# Altium schematic sheet EVK-IRIS-W1-SRAM_RESET_STRAPING.SchDoc: Top Level Design
size A3; CompanyName: Rigado, LLC; Organization: Rigado; DocumentNumber: 11; SheetNumber: 11; SheetTotal: 14; Website: www.rigado.com; SheetSize: B
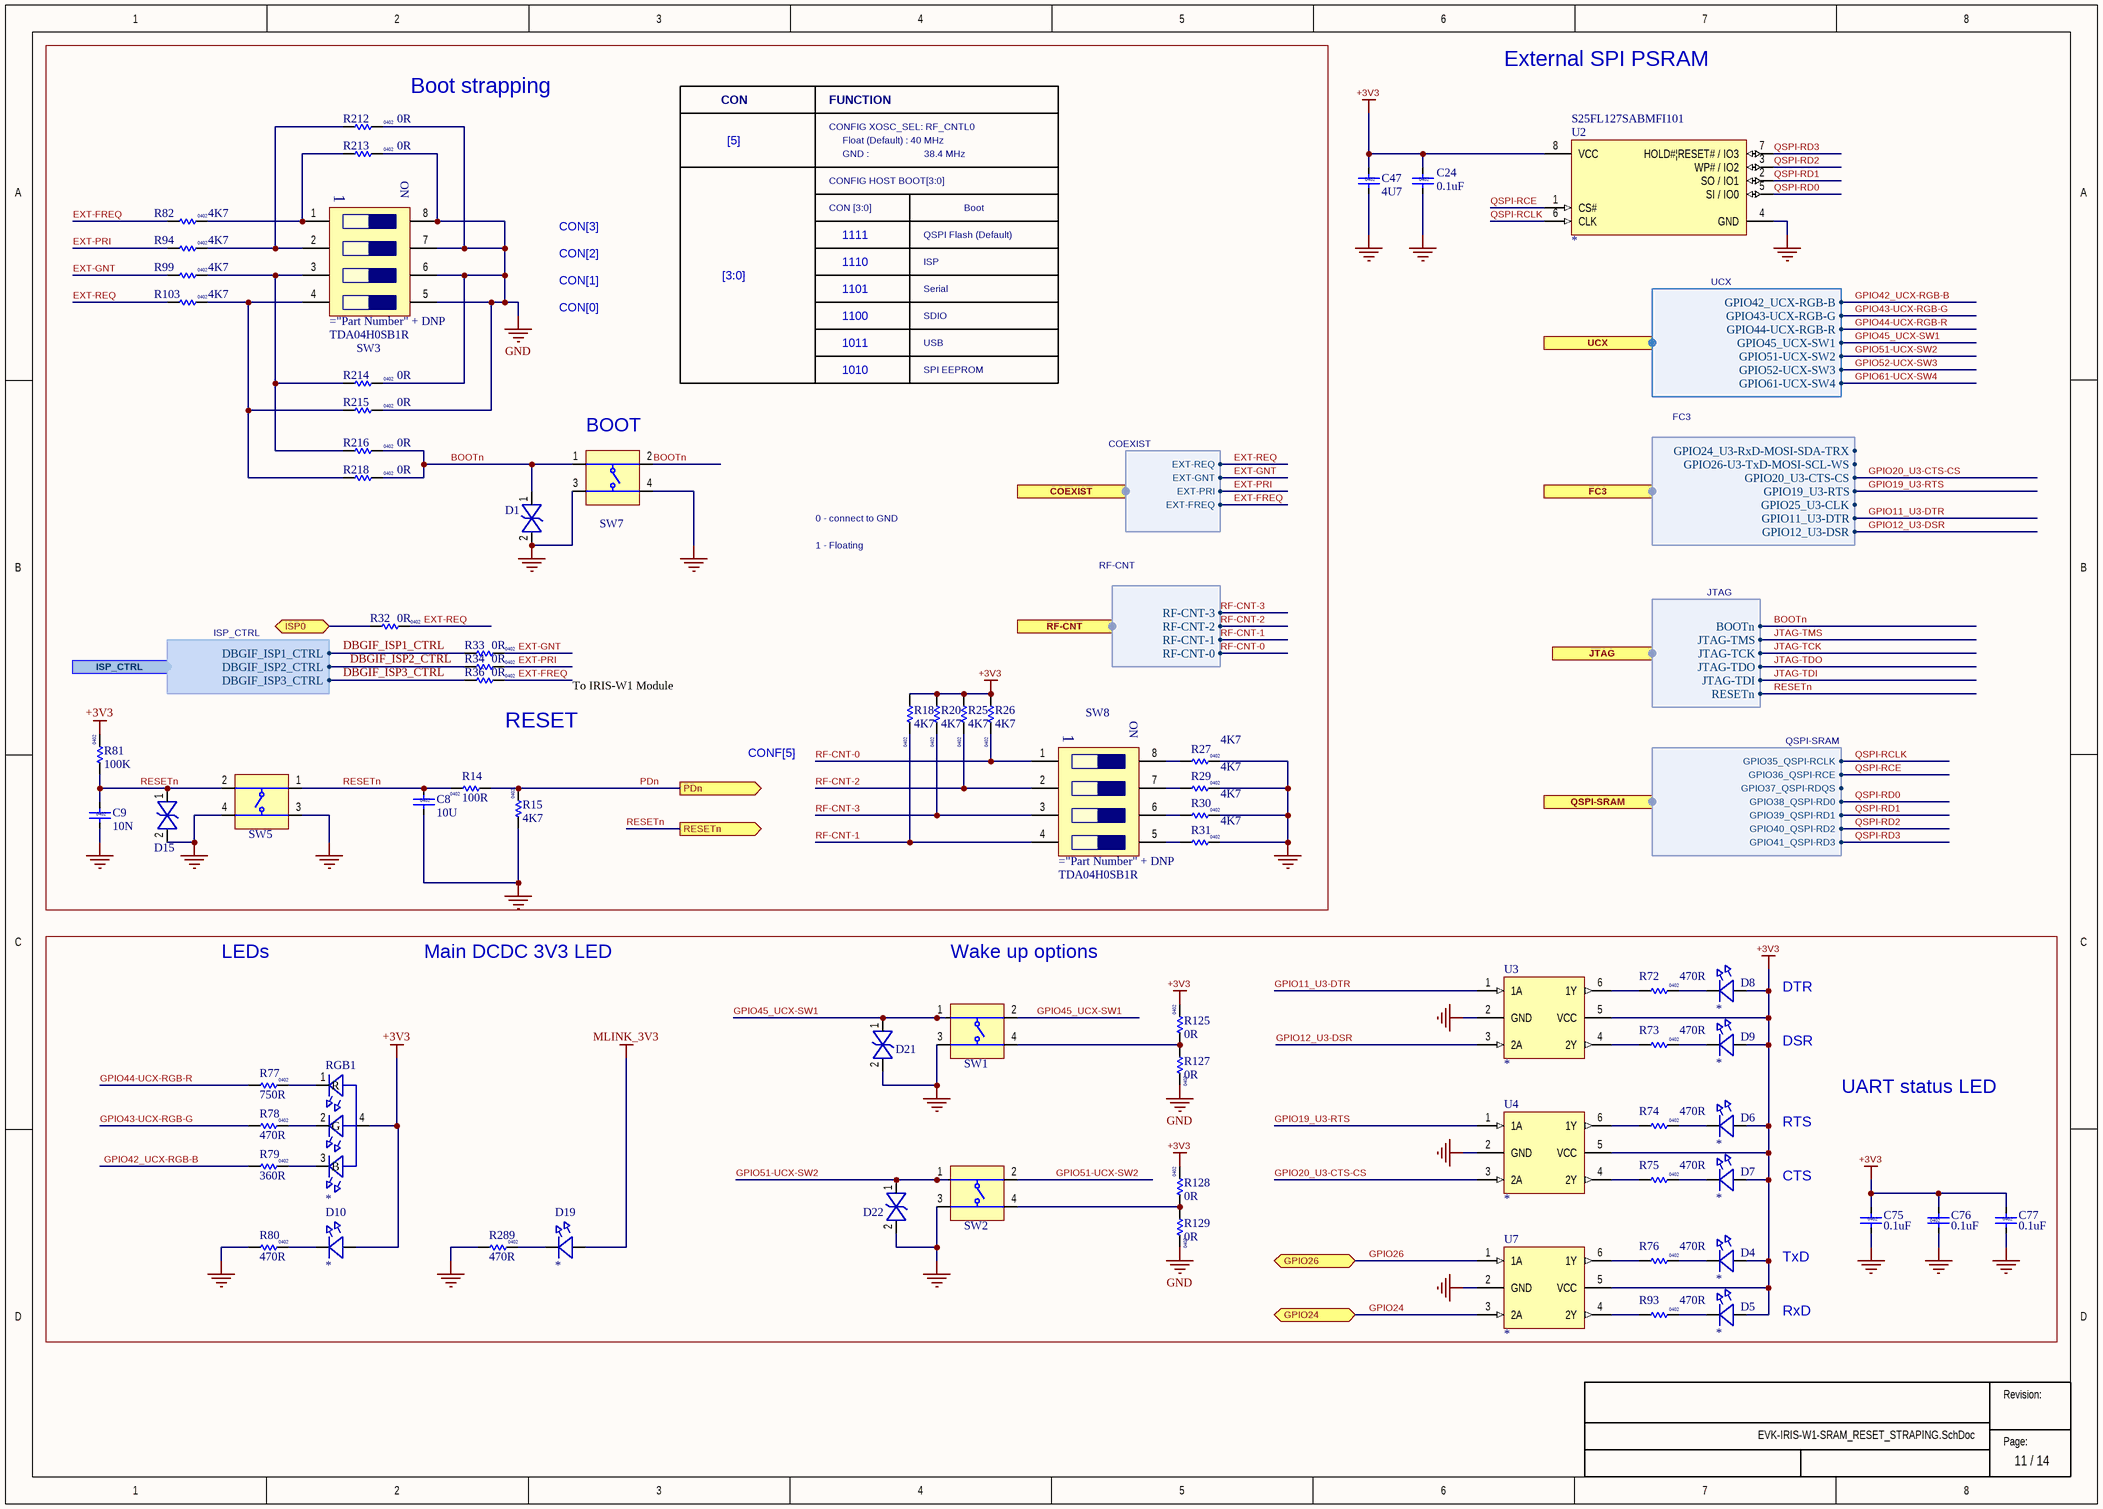
[diagram p0: EVK-IRIS-W1-SRAM_RESET_STRAPING.SchDoc]

## Parts
C8  value 10U  Size: 0402  [Cap 0402 HD]
C9  value 10N  Size: 0402  [Cap 0402]
C24  value 0.1uF  Size: 0402  [Cap 0402 HD]
C47  value 4U7  Size: 0402  [Cap 0402 HD]
C75  value 0.1uF  Size: 0402  [Cap 0402 HD]
C76  value 0.1uF  Size: 0402  [Cap 0402 HD]
C77  value 0.1uF  Size: 0402  [Cap 0402 HD]
D1  (no value)  [SOD-923]
D4  (no value)  [LED-0603]
D5  (no value)  [LED-0603]
D6  (no value)  [LED-0603]
D7  (no value)  [LED-0603]
D8  (no value)  [LED-0603]
D9  (no value)  [LED-0603]
D10  (no value)  [LED-0603]
D15  (no value)  [SOD-923]
D19  (no value)  [LED-0603]
D21  (no value)  [SOD-923]
D22  (no value)  [SOD-923]
R14  value 100R  Size: 0402  [RES 0402 HD]
R15  value 4K7  Size: 0402  [RES 0402 HD]
R18  value 4K7  Size: 0402  [RES 0402 HD]
R20  value 4K7  Size: 0402  [RES 0402 HD]
R25  value 4K7  Size: 0402  [RES 0402 HD]
R26  value 4K7  Size: 0402  [RES 0402 HD]
R27  value 4K7  Size: 0402  [RES 0402 HD]
R29  value 4K7  Size: 0402  [RES 0402 HD]
R30  value 4K7  Size: 0402  [RES 0402 HD]
R31  value 4K7  Size: 0402  [RES 0402 HD]
R32  value 0R  Size: 0402  [RES 0402 HD]
R33  value 0R  Size: 0402  [RES 0402 HD]
R34  value 0R  Size: 0402  [RES 0402 HD]
R36  value 0R  Size: 0402  [RES 0402 HD]
R72  value 470R  Size: 0402  [RES 0402 HD]
R73  value 470R  Size: 0402  [RES 0402 HD]
R74  value 470R  Size: 0402  [RES 0402 HD]
R75  value 470R  Size: 0402  [RES 0402 HD]
R76  value 470R  Size: 0402  [RES 0402 HD]
R77  value 750R  Size: 0402  [RES 0402 HD]
R78  value 470R  Size: 0402  [RES 0402 HD]
R79  value 360R  Size: 0402  [RES 0402 HD]
R80  value 470R  Size: 0402  [RES 0402 HD]
R81  value 100K  Size: 0402  [RES 0402 HD]
R82  value 4K7  Size: 0402  [RES 0402 HD]
R93  value 470R  Size: 0402  [RES 0402 HD]
R94  value 4K7  Size: 0402  [RES 0402 HD]
R99  value 4K7  Size: 0402  [RES 0402 HD]
R103  value 4K7  Size: 0402  [RES 0402 HD]
R125  value 0R  Size: 0402  [RES 0402 HD]
R127  value 0R  Size: 0402  [RES 0402 HD]
R128  value 0R  Size: 0402  [RES 0402 HD]
R129  value 0R  Size: 0402  [RES 0402 HD]
R212  value 0R  Size: 0402  [RES 0402 HD]
R213  value 0R  Size: 0402  [RES 0402 HD]
R214  value 0R  Size: 0402  [RES 0402 HD]
R215  value 0R  Size: 0402  [RES 0402 HD]
R216  value 0R  Size: 0402  [RES 0402 HD]
R218  value 0R  Size: 0402  [RES 0402 HD]
R289  value 470R  Size: 0402  [RES 0402 HD]
RGB1  (no value)  [LED_1616]
SW1  (no value)  [SW_TACT_SMT_6mm]
SW2  (no value)  [SW_TACT_SMT_6mm]
SW3  (no value)  [SOP1.27P6.2x6.2-8Pin]
SW5  (no value)  [SW_TACT_SMT_6mm]
SW7  (no value)  [SW_TACT_SMT_6mm]
SW8  (no value)  [SOP1.27P6.2x6.2-8Pin]
U2  Manufacturer Part Number 1: S25FL127SABMFI101  [SOIC-8W]
U3  (no value)  [SC70-6]
U4  (no value)  [SC70-6]
U7  (no value)  [SC70-6]

## Ports
COEXIST (harness COEXIST), FC3 (harness FC3), GPIO24 (bidir), GPIO26 (bidir), ISP0 (bidir), ISP_CTRL (harness ISP_CTRL), JTAG (harness JTAG), PDn (out), QSPI-SRAM (harness QSPI-SRAM), RESETn (out), RF-CNT (harness RF-CNT), UCX (harness UCX)

## Harnesses
QSPI-SRAM: GPIO35_QSPI-RCLK, GPIO36_QSPI-RCE, GPIO37_QSPI-RDQS, GPIO38_QSPI-RD0, GPIO39_QSPI-RD1, GPIO40_QSPI-RD2, GPIO41_QSPI-RD3
COEXIST: EXT-REQ, EXT-GNT, EXT-PRI, EXT-FREQ
RF-CNT: RF-CNT-0, RF-CNT-1, RF-CNT-2, RF-CNT-3
ISP_CTRL: DBGIF_ISP1_CTRL, DBGIF_ISP2_CTRL, DBGIF_ISP3_CTRL
UCX: GPIO42_UCX-RGB-B, GPIO43-UCX-RGB-G, GPIO44-UCX-RGB-R, GPIO45_UCX-SW1, GPIO51-UCX-SW2, GPIO52-UCX-SW3, GPIO61-UCX-SW4
FC3: GPIO20_U3-CTS-CS, GPIO19_U3-RTS, GPIO24_U3-RxD-MOSI-SDA-TRX, GPIO26-U3-TxD-MOSI-SCL-WS, GPIO25_U3-CLK, GPIO11_U3-DTR, GPIO12_U3-DSR
JTAG: JTAG-TCK, JTAG-TDI, JTAG-TDO, JTAG-TMS, RESETn, BOOTn

## Nets
+3V3: C24.1 C47.1 C75.1 C76.1 C77.1 D4.2(A) D5.2(A) D6.2(A) D7.2(A) D8.2(A) D9.2(A) D10.2(A) R18.2 R20.2 R25.2 R26.2 R81.2 R125.2 R128.2 RGB1.4(A) U2.8(VCC) U3.5(VCC) U4.5(VCC) U7.5(VCC)
GND: C8.2 C9.2 C24.2 C47.2 C75.2 C76.2 C77.2 D1.2 D15.2 D21.2 D22.2 R15.1 R27.2 R29.2 R30.2 R31.2 R80.1 R127.2 R129.2 R212.2 R213.2 R214.2 R215.2 R289.1 SW1.3(T3) SW2.3(T3) SW3.5 SW3.6 SW3.7 SW3.8 SW5.3(T3) SW5.4(T3) SW7.3(T3) SW7.4(T3) U2.4(GND) U3.2(GND) U4.2(GND) U7.2(GND)
MLINK_3V3: D19.2(A)
BOOTn: D1.1 R216.2 R218.2 SW7.1(T1) SW7.2(T2) ; port JTAG.BOOTn
DBGIF_ISP1_CTRL: R33.1 ; port ISP_CTRL.DBGIF_ISP1_CTRL
DBGIF_ISP2_CTRL: R34.1 ; port ISP_CTRL.DBGIF_ISP2_CTRL
DBGIF_ISP3_CTRL: R36.1 ; port ISP_CTRL.DBGIF_ISP3_CTRL
EXT-FREQ: R36.2 R82.1 ; port COEXIST.EXT-FREQ
EXT-GNT: R33.2 R99.1 ; port COEXIST.EXT-GNT
EXT-PRI: R34.2 R94.1 ; port COEXIST.EXT-PRI
EXT-REQ: R32.2 R103.1 ; port COEXIST.EXT-REQ
GPIO11_U3-DTR: U3.1(1A) ; port FC3.GPIO11_U3-DTR
GPIO12_U3-DSR: U3.3(2A) ; port FC3.GPIO12_U3-DSR
GPIO19_U3-RTS: U4.1(1A) ; port FC3.GPIO19_U3-RTS
GPIO20_U3-CTS-CS: U4.3(2A) ; port FC3.GPIO20_U3-CTS-CS
GPIO24: U7.3(2A) ; port GPIO24
GPIO26: U7.1(1A) ; port GPIO26
GPIO42_UCX-RGB-B: R79.1 ; port UCX.GPIO42_UCX-RGB-B
GPIO43-UCX-RGB-G: R78.1 ; port UCX.GPIO43-UCX-RGB-G
GPIO44-UCX-RGB-R: R77.1 ; port UCX.GPIO44-UCX-RGB-R
GPIO45_UCX-SW1: D21.1 SW1.1(T1) SW1.2(T2) ; port UCX.GPIO45_UCX-SW1
GPIO51-UCX-SW2: D22.1 SW2.1(T1) SW2.2(T2) ; port UCX.GPIO51-UCX-SW2
GPIO52-UCX-SW3: port UCX.GPIO52-UCX-SW3
GPIO61-UCX-SW4: port UCX.GPIO61-UCX-SW4
ISP0: R32.1 ; port ISP0
JTAG-TCK: port JTAG.JTAG-TCK
JTAG-TDI: port JTAG.JTAG-TDI
JTAG-TDO: port JTAG.JTAG-TDO
JTAG-TMS: port JTAG.JTAG-TMS
PDn: R14.1 R15.2 ; port PDn
QSPI-RCE: U2.1(CS#) ; port QSPI-SRAM.GPIO36_QSPI-RCE
QSPI-RCLK: U2.6(CLK) ; port QSPI-SRAM.GPIO35_QSPI-RCLK
QSPI-RD0: U2.5(SI_/_IO0) ; port QSPI-SRAM.GPIO38_QSPI-RD0
QSPI-RD1: U2.2(SO_/_IO1) ; port QSPI-SRAM.GPIO39_QSPI-RD1
QSPI-RD2: U2.3(WP#_/_IO2) ; port QSPI-SRAM.GPIO40_QSPI-RD2
QSPI-RD3: U2.7(HOLD#|RESET#_/_IO3) ; port QSPI-SRAM.GPIO41_QSPI-RD3
RESETn: C8.1 C9.1 D15.1 R14.2 R81.1 SW5.1(T1) SW5.2(T2) ; port RESETn, port JTAG.RESETn
RF-CNT-0: R26.1 SW8.1 ; port RF-CNT.RF-CNT-0
RF-CNT-1: R18.1 SW8.4 ; port RF-CNT.RF-CNT-1
RF-CNT-2: R25.1 SW8.2 ; port RF-CNT.RF-CNT-2
RF-CNT-3: R20.1 SW8.3 ; port RF-CNT.RF-CNT-3
NetD4_1: D4.1(C) R76.2
NetD5_1: D5.1(C) R93.2
NetD6_1: D6.1(C) R74.2
NetD7_1: D7.1(C) R75.2
NetD8_1: D8.1(C) R72.2
NetD9_1: D9.1(C) R73.2
NetD10_1: D10.1(C) R80.2
NetD19_1: D19.1(C) R289.2
NetR27_1: R27.1 SW8.8
NetR29_1: R29.1 SW8.7
NetR30_1: R30.1 SW8.6
NetR31_1: R31.1 SW8.5
NetR72_1: R72.1 U3.6(1Y)
NetR73_1: R73.1 U3.4(2Y)
NetR74_1: R74.1 U4.6(1Y)
NetR75_1: R75.1 U4.4(2Y)
NetR76_1: R76.1 U7.6(1Y)
NetR77_2: R77.2 RGB1.1(R)
NetR78_2: R78.2 RGB1.2(G)
NetR79_2: R79.2 RGB1.3(B)
NetR82_2: R82.2 R213.1 SW3.1
NetR93_1: R93.1 U7.4(2Y)
NetR94_2: R94.2 R212.1 SW3.2
NetR99_2: R99.2 R214.1 R216.1 SW3.3
NetR103_2: R103.2 R215.1 R218.1 SW3.4
NetR125_1: R125.1 R127.1 SW1.4(T3)
NetR128_1: R128.1 R129.1 SW2.4(T3)

## Notes on the sheet
- Boot strapping
- CON
- FUNCTION
- External SPI PSRAM
- [5]
- CONFIG XOSC_SEL: RF_CNTL0
- CONFIG HOST BOOT[3:0]
- Float (Default) : 40 MHz
- GND :                      38.4 MHz
- CON[3]
- CON [3:0]
- 1111
- QSPI Flash (Default)
- Boot
- CON[2]
- CON[1]
- CON[0]
- [3:0]
- 1110
- 1101
- 1100
- SDIO
- Serial
- ISP
- 1011
- 1010
- USB
- SPI EEPROM
- (near SW7) BOOT
- 0 - connect to GND
- 1 - Floating
- To IRIS-W1 Module
- RESET
- CONF[5]
- LEDs
- Main DCDC 3V3 LED
- Wake up options
- DTR
- DSR
- RTS
- UART status LED
- CTS
- TxD
- RxD
- Revision:
- Page:
- (in symbol 137-00012) ON

## Library data of the parts
C8 = UBXH01-0000244: CAP CER X5R 0402 10U 20% 10V; Manufacturer: Murata Manufacturing Company, Ltd.; Manufacturer P/N: GRM155R61A106ME11; Editor: dario.antonaz; Released by: jure.podmenik; Env: ROHS; Permitted Use: Volume Products; Perferred: PREF; Mfg P/N Status: Active; Mfg P/N Split: 0; Mfg P/N Released: Yes; Part Number: UBXH01-0000244; Tolerance: 20%; Max Voltage: 10V; Part Type: Capacitor; Release Data: 2016-03-11T16:15:50; UBX Wiki: https://wiki.u-blox.com/bin/view/Operations/PartDetails?index=24334; RefDes: C; Mfg P/N Datasheet: https://wiki.u-blox.com/bin/view/Generic/Docs/DocumentSummary?index=24333; Manufacturer 2: Samsung Electro-Mechanics; Manufacturer P/N 2: CL05A106MP5NUN; Mfg P/N Status 2: NRND; Mfg P/N Split 2: 0; Mfg P/N Released 2: Yes; Mfg P/N Datasheet 2: https://wiki.u-blox.com/bin/view/Generic/Docs/DocumentSummary?index=27636
C9 = UBXH01-0023025: CAP CER X7R 0402 10N 10% 16V; Manufacturer: Murata Manufacturing Company, Ltd.; Manufacturer P/N: GRM155R71C103KA01; Editor: roland.rust; Released by: anthony.gergis; Env: ROHS; Permitted Use: Volume Products; Perferred: PREF; Mfg P/N Status: NRND; Mfg P/N Split: 100; Mfg P/N Released: Yes; Part Number: UBXH01-0023025; Tolerance: 10%; Max Voltage: 16V; Min Operating Temp: -55°C; Max Operating Temp: 125°C; Part Type: Capacitor; Release Data: 2021-02-16T13:14:11; UBX Wiki: https://wiki.u-blox.com/bin/view/Operations/PartDetails?index=5491; RefDes: C; Manufacturer 2: Samsung Electro-Mechanics; Manufacturer P/N 2: CL05B103KO5NNNC; Mfg P/N Status 2: Active; Mfg P/N Split 2: 0; Mfg P/N Released 2: Yes; Mfg P/N Datasheet 2: https://wiki.u-blox.com/bin/view/Generic/Docs/DocumentSummary?index=28567
C24 C75-C77 = 120-00016: Cap, Ceramic 0.1uF 10V 10% X5R 0402; Part Name: CAP CER 0.1UF 10V 10% X5R 0402; Manufacturer 1: Murata Electronics North America; Manufacturer Part Number 1: GRM155R61A104KA01J; Tolerance: +/- 10%; Use in new designs: Yes; UBX Code: None; Item Phase: In Production; Part Number: 120-00016; Revision: 0A; Supplier 1: Digi-Key; Supplier Part Number 1: 490-6297-1-ND; Manufacturer 2: Yageo; Supplier 2: Digi-Key; Supplier Part Number 2: 311-1336-1-ND; Height: 0.55mm; Pins: 2; Temperature Coefficient: X5R; Voltage: 10V; Max Operating Temp: 85; Manufacturer Part Number 2: CC0402KRX5R6BB104; Min Operating Temp: -55
C47 = UBXH01-0000243: CAP CER X5R 0402 4U7 20% 10V; Manufacturer: Murata Manufacturing Company, Ltd.; Manufacturer P/N: GRM155R61A475MEAA; Editor: martin.pilik; Released by: fabrice.bret-dibat; Env: GREEN; Permitted Use: Volume Products; Perferred: PREF; Mfg P/N Status: Active; Mfg P/N Split: 100; Mfg P/N Released: Yes; Part Number: UBXH01-0000243; Tolerance: 20%; Max Voltage: 10V; Min Operating Temp: -40°C; Max Operating Temp: 85°C; Part Type: Capacitor; Release Data: 2021-05-10T12:57:47; UBX Wiki: https://wiki.u-blox.com/bin/view/Operations/PartDetails?index=24303; RefDes: C; Mfg P/N Datasheet: https://wiki.u-blox.com/bin/view/Generic/Docs/DocumentSummary?index=24302
D1 D15 D21 D22 = 110-00019: Diode, ESD9B, 3.3V, ST5G, SOD-923; Part Name: Diode TVS 3.3V SOD-923; Manufacturer 1: ON Semiconductor; Manufacturer Part Number 1: ESD9B3.3ST5G; Body Size: 0.8mm x 0.6mm; Use in new designs: Yes; UBX Code: None; Item Phase: In Production; Part Number: 110-00019; Supplier 1: Digi-Key; Supplier Part Number 1: ESD9B3.3ST5GOSCT-ND; Height: 0.4mm; MFG Package: SOD-923; Pins: 2; Voltage: 3.3V; Manufacturer 2: ON Semiconductor; Max Operating Temp: 150; Supplier 2: Arrow; Supplier Part Number 2: ESD9B3.3ST5G; Manufacturer Part Number 2: ESD9B3.3ST5G; Current: None; Min Operating Temp: -55; Revision: 0A
D4-D10 D19 = UBXH11-0000018: LED CHIP 0603 LOW CURRENT OSRAM 0.002A GREEN 2.2V 2mA; Manufacturer P/N: LG L29K-G2J1-24; Editor: johann.furrer; Released by: martin.grasse; Env: ROHS; Permitted Use: Volume Products; Perferred: PREF; Mfg P/N Status: Active; Mfg P/N Split: 100; Mfg P/N Released: Yes; Color: *; Part Number: UBXH11-0000018; Value: GREEN; Max Voltage: 2.2V; Max Current: 2mA; Size: 0603; Min Operating Temp: -40°C; Max Operating Temp: 85°C; Part Type: LED; Release Data: 2018-01-09T15:31:38; UBX Wiki: https://wiki.u-blox.com/bin/view/Operations/PartDetails?index=20619; RefDes: DS; Manufacturer: Osram; Mfg P/N Datasheet: https://wiki.u-blox.com/bin/view/Generic/Docs/DocumentSummary?index=20620
R14 = UBXH18-0000504: RES THIN FILM CHIP 0402 100R 0.1% 100mW; Manufacturer: YAGEO; Manufacturer P/N: RT0402BRD07100RL; Editor: martin.kessel; Env: ROHS; Permitted Use: Internal Use; Perferred: PREF; Mfg P/N Status: Active; Mfg P/N Split: 100; Mfg P/N Released: No; Part Number: UBXH18-0000504; Tolerance: 0.1%; Max Power: 100mW; Min Operating Temp: -55°C; Max Operating Temp: 155°C; Part Type: Resistor; UBX Wiki: https://wiki.u-blox.com/bin/view/Operations/PartDetails?index=31120; RefDes: R; Mfg P/N Datasheet: https://wiki.u-blox.com/bin/view/Generic/Docs/DocumentSummary?index=19276
R15 R18 R20 R25-R27 R29-R31 R82 R94 R99 R103 = UBXH18-0000213: RES THICK FILM CHIP 0402 4K7 1% 63mW; Manufacturer: KOA; Manufacturer P/N: RK73H1ETTP4701F; Editor: michael.hein; Released by: vasyl.dykyy; Env: ROHS; Permitted Use: Volume Products; Perferred: PREF; Mfg P/N Status: Active; Mfg P/N Split: 100; Mfg P/N Released: Yes; Part Number: UBXH18-0000213; Tolerance: 1%; Max Power: 63mW; Part Type: Resistor; Release Data: 2015-10-02T11:47:33; Automotive: Yes; UBX Wiki: https://wiki.u-blox.com/bin/view/Operations/PartDetails?index=23300; RefDes: R; Mfg P/N Datasheet: https://wiki.u-blox.com/bin/view/Generic/Docs/DocumentSummary?index=8222
R32-R34 R36 R125 R127-R129 R212-R216 R218 = UBXH18-0003002: RES THICK FILM CHIP 0402 0R 0 100mW; Manufacturer: KOA; Manufacturer P/N: RK73Z1ETTD; Tolerance: 0; Editor: charlotte.biber; Released by: peter.mueller; Env: ROHS; Permitted Use: Volume Products; Perferred: PREF; Mfg P/N Status: NRND; Mfg P/N Split: 100; Mfg P/N Released: Yes; Part Number: UBXH18-0003002; Manufacturer 2: YAGEO; Max Power: 100mW; Part Type: Resistor; Release Data: 2012-06-05T09:49:55; UBX Wiki: https://wiki.u-blox.com/bin/view/Operations/PartDetails?index=6611; RefDes: R; Manufacturer P/N 2: 2322_705_91001_L; Mfg P/N Status 2: NRND; Mfg P/N Split 2: 0; Mfg P/N Released 2: Yes
R72-R76 R78 R80 R93 R289 = UBXH18-0008041: RES THICK FILM CHIP 0402 470R 5% 100mW; Manufacturer: ROHM; Manufacturer P/N: MCR01MZPJ471; Editor: roland.rust; Env: ROHS; Permitted Use: Volume Products; Perferred: PREF; Mfg P/N Status: Active; Mfg P/N Split: 100; Mfg P/N Released: Yes; Part Number: UBXH18-0008041; Tolerance: 5%; Max Power: 100mW; Part Type: Resistor; Released by: roland.rust; Release Data: 2009-04-24T14:36:39; UBX Wiki: https://wiki.u-blox.com/bin/view/Operations/PartDetails?index=6926; RefDes: R; Manufacturer 2: KOA; Manufacturer P/N 2: RK73B1ETTP471J; Mfg P/N Status 2: Active; Mfg P/N Split 2: 0; Mfg P/N Released 2: Yes; Manufacturer 3: YAGEO; Manufacturer P/N 3: 2322_705_87471_L; Mfg P/N Status 3: NRND; Mfg P/N Split 3: 0; Mfg P/N Released 3: Yes
R77 = UBXH18-0008046: RES THICK FILM CHIP 0402 750R 5% 100mW; Manufacturer: Panasonic; Manufacturer P/N: ERJ2GEJ751X; Editor: jaka.bevk; Released by: erian.bezhani; Env: ROHS; Permitted Use: Volume Products; Perferred: PREF; Mfg P/N Status: Active; Mfg P/N Split: 100; Mfg P/N Released: Yes; Part Number: UBXH18-0008046; Tolerance: 5%; Max Power: 100mW; Part Type: Resistor; Release Data: 2014-10-03T09:31:33; UBX Wiki: https://wiki.u-blox.com/bin/view/Operations/PartDetails?index=6935; RefDes: R; Mfg P/N Datasheet: https://wiki.u-blox.com/bin/view/Generic/Docs/DocumentSummary?index=21267
R79 = UBXH18-0000216: RES THICK FILM CHIP 0402 360R 1% 63mW; Manufacturer: KOA; Manufacturer P/N: RK73H1ETTP3600F; Editor: michael.hein; Released by: vasyl.dykyy; Env: ROHS; Permitted Use: Volume Products; Perferred: PREF; Mfg P/N Status: Active; Mfg P/N Split: 100; Mfg P/N Released: Yes; Part Number: UBXH18-0000216; Tolerance: 1%; Max Power: 63mW; Part Type: Resistor; Release Data: 2015-10-02T11:55:45; Automotive: Yes; UBX Wiki: https://wiki.u-blox.com/bin/view/Operations/PartDetails?index=23306; RefDes: R; Mfg P/N Datasheet: https://wiki.u-blox.com/bin/view/Generic/Docs/DocumentSummary?index=8222
R81 = UBXH18-0008097: RES THICK FILM CHIP 0402 100K 5% 100mW; Manufacturer: YAGEO; Manufacturer P/N: 2322_705_70104_L; Editor: roland.rust; Env: ROHS; Permitted Use: Volume Products; Perferred: PREF; Mfg P/N Status: NRND; Mfg P/N Split: 100; Mfg P/N Released: Yes; Part Number: UBXH18-0008097; Tolerance: 5%; Max Power: 100mW; Part Type: Resistor; Released by: roland.rust; Release Data: 2005-07-22T13:59:44; UBX Wiki: https://wiki.u-blox.com/bin/view/Operations/PartDetails?index=7020; RefDes: R; Manufacturer 2: KOA; Manufacturer P/N 2: RK73B1ETTD104J; Mfg P/N Status 2: NRND; Mfg P/N Split 2: 0; Mfg P/N Released 2: Yes
RGB1 = 115-00026: LED RGB SMT 0606; Manufacturer 1: Lite-On Inc; Manufacturer Part Number 1: LTST-C19HE1WT; Body Size: 1.6mm x 1.6mm; Current: 20mA; Item Phase: In Production; MFG Package: 0606; Use in new designs: Yes; Voltage: None; Color: *; Part Number: 115-00026; Supplier 1: Digi-Key; Supplier Part Number 1: 160-2162-1-ND; Height: 0.35mm; Max Operating Temp: 80; Min Operating Temp: -20; Part Name: LED RGB SMT 0606; Pins: 4; Revision: 0B; Size: Other; UBX Code: None; Manufacturer 2: QT Brightek (QTB); Manufacturer Part Number 2: QBLP600-RGB; Supplier 2: Digi-Key; Supplier Part Number 2: 1516-1184-1-ND
SW1 SW2 SW5 SW7 = 135-00002: Tactile Switch, SPST-NO, SMT, Actuation force = 160g, 6mm x 6mm; Part Name: Button Tactile SPST-NO 50mA 6mm SMT; Manufacturer 1: C&K Components; Manufacturer Part Number 1: PTS645SM43SMTR92 LFS; Current: 50mA; Use in new designs: Yes; Voltage: 12VDC; UBX Code: None; Item Phase: In Production; Part Number: 135-00002; Supplier 1: Digi-Key; Supplier Part Number 1: CKN9112CT-ND; Body Size: 6mm x 6mm; Height: 4.4mm; Pins: 4; Revision: 0B; Manufacturer 2: Seeed Technology; Supplier 2: Seeed Technology; Supplier Part Number 2: Rigado 135-00002; Max Operating Temp: 60; Min Operating Temp: -20; Manufacturer Part Number 2: Rigado 135-00002
SW3 SW8 = 137-00012: Dip Switch SPST 4 Position Surface Mount Slide (Standard) Actuator 25mA 24VDC; Manufacturer 1: C&K Components; Item_Phase: Pre-Production; Component Mounting Type: SMT; Switch/Button Function: On-Off; Use in new designs: Yes; Voltage: 24V; Item Phase: Unreleased; UBX Code: None; Part Number: 137-00012; Part Name: TDA04H0SB1R; Part_Type: Switch; Revision: A; Supplier 1: Digi-Key; Supplier Part Number 1: CKN9502TR-ND; Arena Link: https://app.bom.com/a/4M5DJQ9Q9SR7OCE3?v=spec.summary; Current: 25mA; Height: 2.35mm; Length: 6.2mm; Pins: 8; Switch/Button Circuit: SPST; Width: 6.2mm; Manufacturer Part Number 1: TDA04H0SB1R; Max Operating Temp: 85; Min Operating Temp: -40; Manufacturer 2: None; Manufacturer Part Number 2: None; Supplier 2: None; Supplier Part Number 2: None
U2 = 240-00017: IC, Flash 128MBIT, 108MHz, 8SOIC; Manufacturer 1: Cypress Semiconductor Corp; Part Name: IC Flash 128MBIT 108MHz 8SOIC; Body Size: 5.28mm x 5.28mm; Interface: SPI; Item Phase: Unreleased; Memory Type: Flash - NOR; MFG Package: 8-SOIC; SMT Pitch: 1.27mm; Thermal Pad: No; Use in new designs: Yes; Voltage: 3.6V; UBX Code: None; Manufacturer P/N: *; Part Number: 240-00017; Supplier 1: Digi-Key; Supplier Part Number 1: 1274-1045-ND; Height: 2.16mm; Memory Size: 128Mbit; Memory Speed: 108MHz; Max Operating Temp: 85; Min Operating Temp: -40; Pins: 8; Revision: None; Manufacturer 2: None; Manufacturer Part Number 2: None; Supplier 2: None; Supplier Part Number 2: None
U3 U4 U7 = 225-00022: Buffer, Non-Inverting 2 Element 1 Bit per Element Push-Pull Output SC-70-6; Manufacturer 1: Texas Instruments; Manufacturer Part Number 1: SN74LVC2G34DCKR; Part Name: IC BUF NON-INVERT 5.5V SC70-6; Body Size: 1.25mm x 2mm; Item Phase: In Production; SMT Pitch: 0.65mm; Thermal Pad: No; Use in new designs: Yes; Voltage: 5.5V; UBX Code: None; Manufacturer P/N: *; Part Number: 225-00022; Supplier 1: Digi-Key; Supplier Part Number 1: 296-13497-1-ND; Height: 1.1mm; Logic Type: Buffer; MFG Package: SC-70-6; Max Operating Temp: 125; Min Operating Temp: -40; Pins: 6; Revision: 0A; Manufacturer 2: ON Semiconductor; Manufacturer Part Number 2: NC7WZ16P6X; Supplier 2: Digi-Key; Supplier Part Number 2: NC7WZ16P6XCT-ND